# EAGLE schematic SparkFun LoRaSerial 915MHz - 1W (EAGLE 9.6.2)
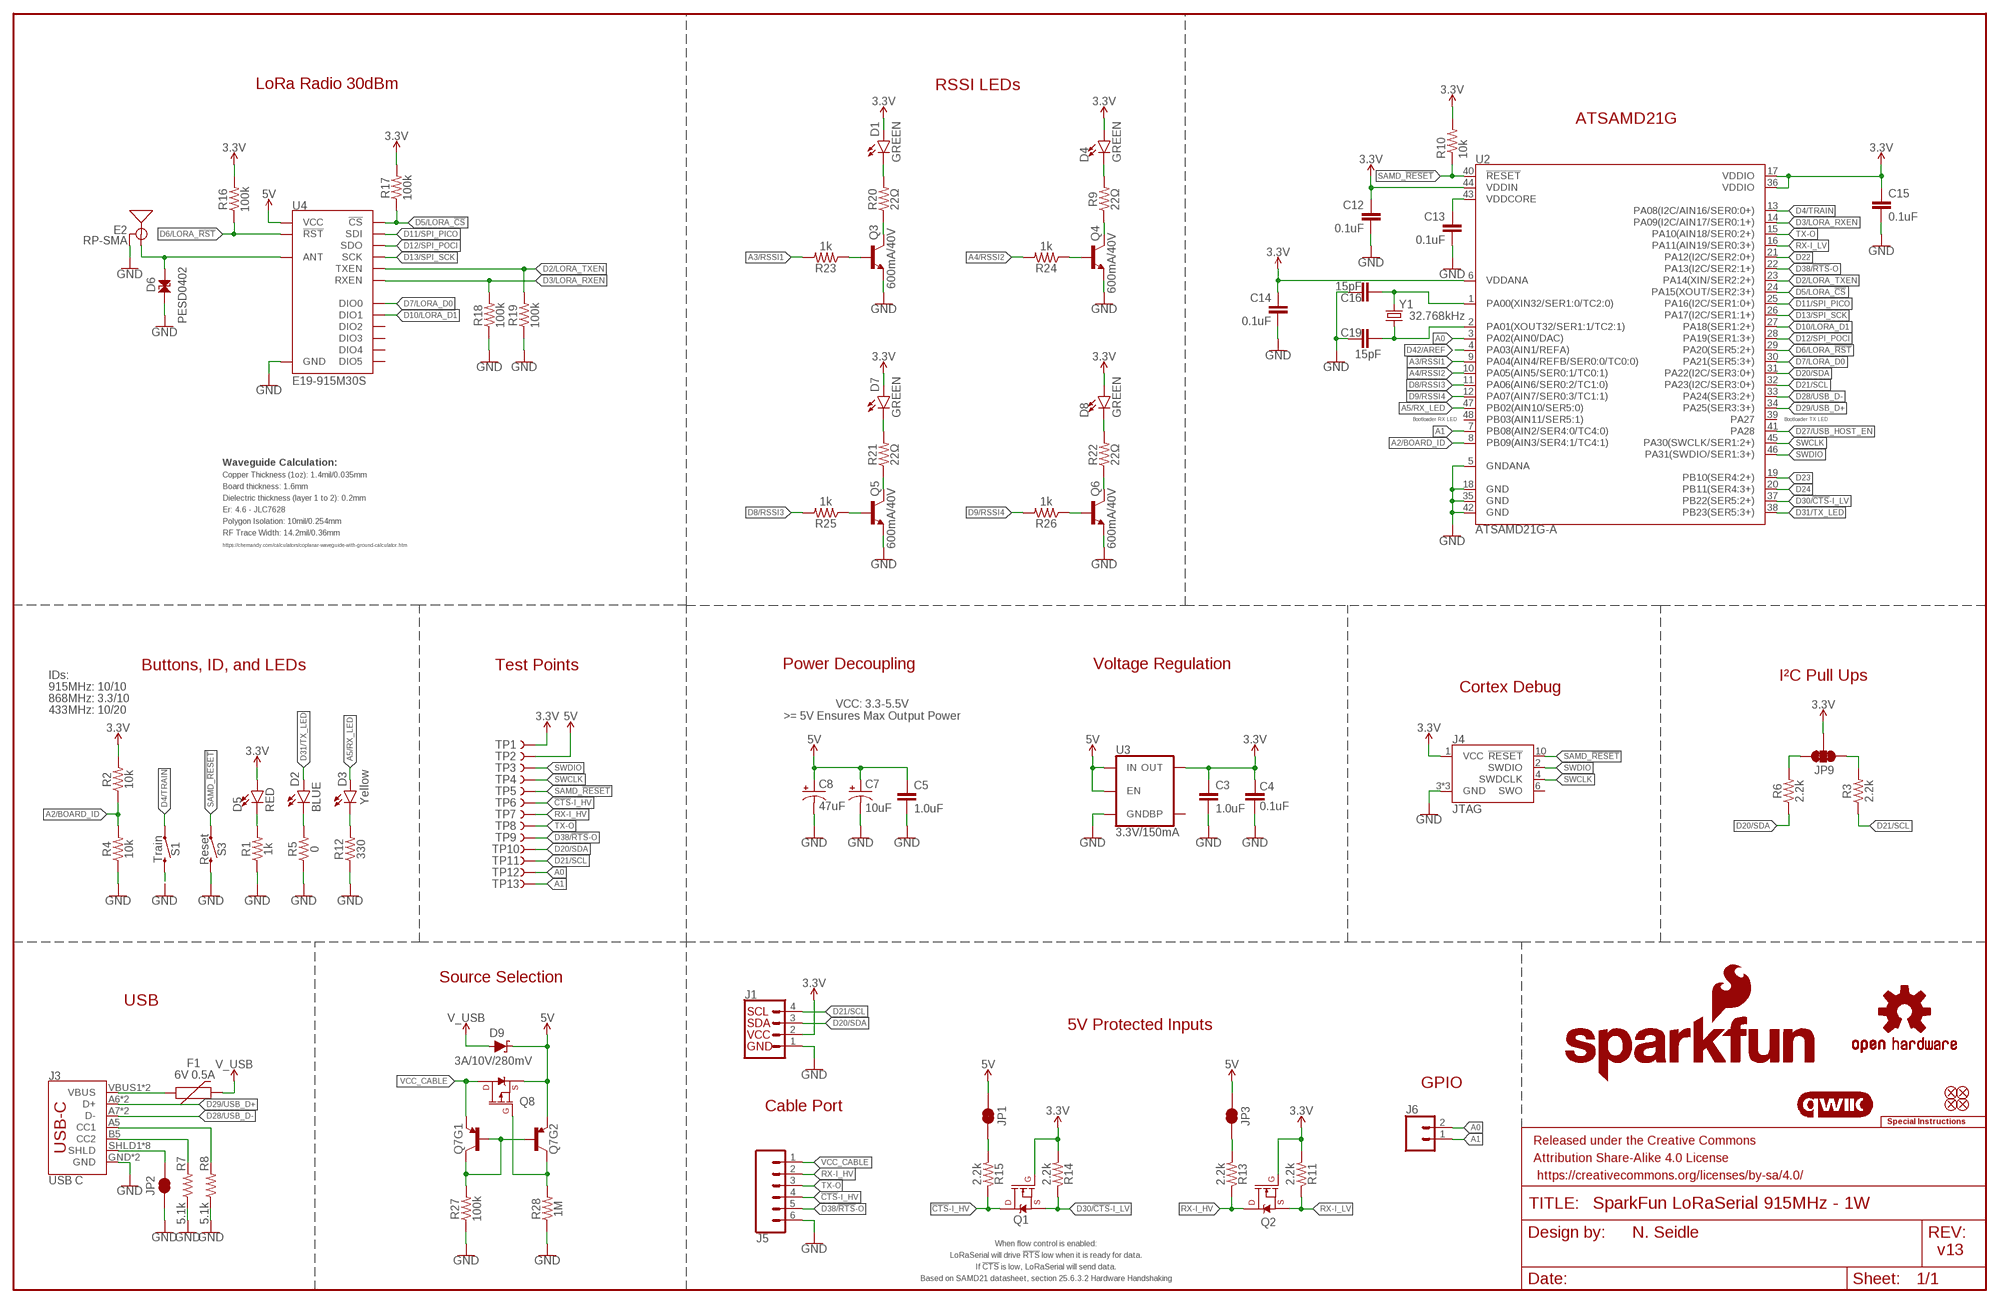
[diagram p0: schematic, sheet 1]

## Parts
C3  1.0uF  1.0UF-0603-16V-10%-X7R  [0603]
C4  0.1uF  0.1UF-0603-25V-5%  [0603]
C5  1.0uF  1.0UF-0603-16V-10%-X7R  [0603]
C7  10uF  10UF-POLAR-EIA3216-16V-10%(TANT)  [EIA3216]
C8  47uF  47UF-POLAR-EIA3528-10V-10%  [EIA3528]
C12  0.1uF  0.1UF-0603-25V-(+80/-20%)  [0603]
C13  0.1uF  0.1UF-0603-25V-(+80/-20%)  [0603]
C14  0.1uF  0.1UF-0603-25V-(+80/-20%)  [0603]
C15  0.1uF  0.1UF-0603-25V-(+80/-20%)  [0603]
C16  15pF  15PF-0603-50V-5%  [0603]
C19  15pF  15PF-0603-50V-5%  [0603]
D1  GREEN  LED-GREEN0603  [LED-0603]
D2  BLUE  LED-BLUE0603  [LED-0603]
D3  Yellow  LED-YELLOW0603  [LED-0603]
D4  GREEN  LED-GREEN0603  [LED-0603]
D5  RED  LED-RED0603  [LED-0603]
D6  PESD0402  PESD0402-0402T  [0402-TIGHT]
D7  GREEN  LED-GREEN0603  [LED-0603]
D8  GREEN  LED-GREEN0603  [LED-0603]
D9  3A/10V/280mV  DIODE-SCHOTTKY-BAT60A  [SOD-323]
E2  RP-SMA  ANTENNA-SMA-GROUNDEDEDGE_RPSMA  [RP-SMA-EDGE]
F1  6V 0.5A  PPTC_6V500MA  [0805]
FID1  FIDUCIAL1X2  [FIDUCIAL-1X2]
FID2  FIDUCIAL1X2  [FIDUCIAL-1X2]
FID3  FIDUCIAL1X2  [FIDUCIAL-1X2]
FID4  FIDUCIAL1X2  [FIDUCIAL-1X2]
FRAME3  FRAME-LEDGER  [CREATIVE_COMMONS]
J1  QWIIC_RIGHT_ANGLE  QWIIC_CONNECTORJS-1MM  [JST04_1MM_RA]
J3  USB C  USB_C16PIN  [USB-C-16P]
J4  JTAG  CORTEX_JTAG_DEBUG_MINIMUM_PTH_NS  [2X5-PTH-1.27MM-NO_SILK]
J5  CONN_06JST-SMD-LOCKING  [JST-6-SMD-1.25MM-LOCKING]
J6  CONN_021X02_NO_SILK  [1X02_NO_SILK]
JP1  JUMPER-SMT_2_NC_TRACE_SILK  [SMT-JUMPER_2_NC_TRACE_SILK]
JP2  JUMPER-SMT_2_NC_TRACE_SILK  [SMT-JUMPER_2_NC_TRACE_SILK]
JP3  JUMPER-SMT_2_NC_TRACE_SILK  [SMT-JUMPER_2_NC_TRACE_SILK]
JP9  JUMPER-SMT_3_2-NC_TRACE_SILK  [SMT-JUMPER_3_2-NC_TRACE_SILK]
LOGO1  SPECIAL_INSTRUCTIONS-ORDERING  [ORDERING_INSTRUCTIONS]
LOGO2  SFE_LOGO_NAME_FLAME9_MM  [SFE_LOGO_NAME_FLAME_9MM]
LOGO3  QWIIC_LOGO_CONNECTOR  [QWIIC_5.5MM]
LOGO4  OSHW-LOGOMINI  [OSHW-LOGO-MINI]
LOGO5  SFE_LOGO_NAME9_MM  [SFE_LOGO_NAME_9MM]
Q1  20V/0.2A/8MHz/1.2Ω/1Vth  MOSFET-NCH-RE1C002UNTCL  [SOT-416FL]
Q2  20V/0.2A/8MHz/1.2Ω/1Vth  MOSFET-NCH-RE1C002UNTCL  [SOT-416FL]
Q3  600mA/40V  TRANS_NPN-MMBT2222AL  [SOT23-3]
Q4  600mA/40V  TRANS_NPN-MMBT2222AL  [SOT23-3]
Q5  600mA/40V  TRANS_NPN-MMBT2222AL  [SOT23-3]
Q6  600mA/40V  TRANS_NPN-MMBT2222AL  [SOT23-3]
Q7  TRANS_PNP_DUALSOT-363  [SOT363_PHILIPS]
Q8  20V/4.2A/52mΩ/1.4W  MOSFET_PCH-DMG2305UX-7  [SOT23-3]
R1  1k  1KOHM-0603-1/10W-1%  [0603]
R2  10k  10KOHM-0603-1/10W-1%  [0603]
R3  2.2k  2.2KOHM-0603-1/10W-1%  [0603]
R4  10k  10KOHM-0603-1/10W-1%  [0603]
R5  0  0OHM-0603-1/10W  [0603]
R6  2.2k  2.2KOHM-0603-1/10W-1%  [0603]
R7  5.1k  5.1KOHM5.1KOHM-0603-1/10W-1%  [0603]
R8  5.1k  5.1KOHM5.1KOHM-0603-1/10W-1%  [0603]
R9  22Ω  22OHM-0603-1/10W-1%  [0603]
R10  10k  10KOHM-0603-1/10W-1%  [0603]
R11  2.2k  2.2KOHM-0603-1/10W-1%  [0603]
R12  330  330OHM-0603-1/10W-1%  [0603]
R13  2.2k  2.2KOHM-0603-1/10W-1%  [0603]
R14  2.2k  2.2KOHM-0603-1/10W-1%  [0603]
R15  2.2k  2.2KOHM-0603-1/10W-1%  [0603]
R16  100k  100KOHM-0603-1/10W-1%  [0603]
R17  100k  100KOHM-0603-1/10W-1%  [0603]
R18  100k  100KOHM-0603-1/10W-1%  [0603]
R19  100k  100KOHM-0603-1/10W-1%  [0603]
R20  22Ω  22OHM-0603-1/10W-1%  [0603]
R21  22Ω  22OHM-0603-1/10W-1%  [0603]
R22  22Ω  22OHM-0603-1/10W-1%  [0603]
R23  1k  1KOHM-0603-1/10W-1%  [0603]
R24  1k  1KOHM-0603-1/10W-1%  [0603]
R25  1k  1KOHM-0603-1/10W-1%  [0603]
R26  1k  1KOHM-0603-1/10W-1%  [0603]
R27  100k  100KOHM-0603-1/10W-1%  [0603]
R28  1M  1MOHM-0603-1/4W-5%  [0603]
S1  Train  MOMENTARY-SWITCH-SPST-SMD-RIGHT-ANGLE  [TACTILE_SWITCH_SMD_RIGHT_ANGLE]
S3  Reset  MOMENTARY-SWITCH-SPST-SMD-5.2-TALL-REDUNDANT  [TACTILE_SWITCH_SMD_5.2MM]
TP1  TEST-POINT3X5  [PAD.03X.05]
TP2  TEST-POINT3X5  [PAD.03X.05]
TP3  TEST-POINT3X5  [PAD.03X.05]
TP4  TEST-POINT3X5  [PAD.03X.05]
TP5  TEST-POINT3X5  [PAD.03X.05]
TP6  TEST-POINT3X5  [PAD.03X.05]
TP7  TEST-POINT3X5  [PAD.03X.05]
TP8  TEST-POINT3X5  [PAD.03X.05]
TP9  TEST-POINT3X5  [PAD.03X.05]
TP10  TEST-POINT3X5  [PAD.03X.05]
TP11  TEST-POINT3X5  [PAD.03X.05]
TP12  TEST-POINT3X5  [PAD.03X.05]
TP13  TEST-POINT3X5  [PAD.03X.05]
U2  ATSAMD21G-A  [TQFP-48]
U3  3.3V/150mA  V_REG_MIC52053.3V  [SOT23-5]
U4  E19-915M30S  LORA-E19915MHZ  [E19-915M30S]
Y1  32.768kHz  CRYSTAL3.2X1.5MM  [CRYSTAL-SMD-3.2X1.5MM]

## Nets
3.3V [power]: C3.1 C4.2 C12.1 C14.1 C15.1 D1.A D4.A D5.A D7.A D8.A J1.2 J4.1(VCC) JP9.2 Q1.1(G) Q2.1(G) R2.2 R10.2 R11.2 R14.2 R16.2 R17.2 TP1.1 U2.6(VDDANA) U2.17(VDDIO) U2.36(VDDIO) U2.44(VDDIN) U3.5(OUT)
5V: C5.1 C7.+ C8.A(+) D9.C JP1.2 JP3.2 Q7.4(E) Q8.2(S) TP2.1 U3.1(IN) U3.3(EN) U4.11(VCC)
!CTS!-I_HV: J5.4 Q1.3(D) R15.1 TP6.1
A0: J6.2 TP12.1 U2.3(PA02(AIN0/DAC))
A1: J6.1 TP13.1 U2.7(PB08(AIN2/SER4:0/TC4:0))
A2/BOARD_ID: R2.1 R4.2 U2.8(PB09(AIN3/SER4:1/TC4:1))
A3/RSSI1: R23.2 U2.9(PA04(AIN4/REFB/SER0:0/TC0:0))
A4/RSSI2: R24.2 U2.10(PA05(AIN5/SER0:1/TC0:1))
A5/RX_LED: D3.A U2.47(PB02(AIN10/SER5:0))
CC1: J3.A5(CC1) R8.2
CC2: J3.B5(CC2) R7.2
D2/LORA_TXEN: R19.2 U2.23(PA14(XIN/SER2:2+)) U4.16(TXEN)
D3/LORA_RXEN: R18.2 U2.14(PA09(I2C/AIN17/SER0:1+)) U4.17(RXEN)
D4/TRAIN: S1.1 U2.13(PA08(I2C/AIN16/SER0:0+))
D5/LORA_!CS!: R17.1 U2.24(PA15(XOUT/SER2:3+)) U4.15(!CS)
D6/LORA_!RST!: R16.1 U2.29(PA20(SER5:2+)) U4.8(!RST)
D7/LORA_D0: U2.30(PA21(SER5:3+)) U4.7(DIO0)
D8/RSSI3: R25.2 U2.11(PA06(AIN6/SER0:2/TC1:0))
D9/RSSI4: R26.2 U2.12(PA07(AIN7/SER0:3/TC1:1))
D10/LORA_D1: U2.27(PA18(SER1:2+)) U4.6(DIO1)
D11/SPI_PICO: U2.25(PA16(I2C/SER1:0+)) U4.14(SDI)
D12/SPI_POCI: U2.28(PA19(SER1:3+)) U4.13(SDO)
D13/SPI_SCK: U2.26(PA17(I2C/SER1:1+)) U4.12(SCK)
D20/SDA: J1.3 R6.1 TP10.1 U2.31(PA22(I2C/SER3:0+))
D21/SCL: J1.4 R3.1 TP11.1 U2.32(PA23(I2C/SER3:0+))
D22: U2.21(PA12(I2C/SER2:0+))
D23: U2.19(PB10(SER4:2+))
D24: U2.20(PB11(SER4:3+))
D27/USB_HOST_EN: U2.41(PA28)
D28/USB_D-: J3.A7(D-) J3.B7(D-) U2.33(PA24(SER3:2+))
D29/USB_D+: J3.A6(D+) J3.B6(D+) U2.34(PA25(SER3:3+))
D30/!CTS!-I_LV: Q1.2(S) R14.1 U2.37(PB22(SER5:2+))
D31/TX_LED: D2.A U2.38(PB23(SER5:3+))
D38/!RTS!-O: J5.5 TP9.1 U2.22(PA13(I2C/SER2:1+))
D42/AREF: U2.4(PA03(AIN1/REFA))
GND: C3.2 C4.1 C5.2 C7.- C8.C(-) C12.2 C13.2 C14.2 C15.2 C16.1 C19.2 D6.1 E2.GND@0(GND) E2.GND@1(GND) E2.GND@2(GND) E2.GND@3(GND) J1.1 J3.GND J3.GND2(GND) J4.3(GND) J4.5(GND) J4.9(GND) J5.6 JP2.1 Q3.2(E) Q4.2(E) Q5.2(E) Q6.2(E) R1.1 R4.1 R5.1 R7.1 R8.1 R12.1 R18.1 R19.1 R27.1 R28.1 S1.2 S3.3 S3.4 U2.5(GNDANA) U2.18(GND) U2.35(GND) U2.42(GND) U3.2(GND) U4.1(GND) U4.9(GND) U4.10(GND) U4.18(GND) U4.20(GND) U4.21(GND) U4.22(GND)
LORA_ANT: D6.2 E2.SIG(SIGNAL) U4.19(ANT)
N$1: C19.1 U2.2(PA01(XOUT32/SER1:1/TC2:1)) Y1.P$1
N$2: C16.2 U2.1(PA00(XIN32/SER1:0/TC2:0)) Y1.P$2
N$3: D3.C R12.2
N$4: D2.C R5.2
N$5: JP3.1 R13.2
N$6: JP1.1 R15.2
N$7: D5.C R1.2
N$8: D4.C R9.2
N$9: D1.C R20.2
N$10: D7.C R21.2
N$11: D8.C R22.2
N$12: Q3.3(C) R20.1
N$13: Q3.1(B) R23.1
N$14: Q4.3(C) R9.1
N$15: Q4.1(B) R24.1
N$16: Q5.3(C) R21.1
N$17: Q5.1(B) R25.1
N$18: Q6.3(C) R22.1
N$19: Q6.1(B) R26.1
N$20: J3.SHLD1(SHLD) J3.SHLD2(SHLD) J3.SHLD3(SHLD) J3.SHLD4(SHLD) J3.SHLD5(SHLD) J3.SHLD6(SHLD) J3.SHLD7(SHLD) J3.SHLD8(SHLD) JP2.2
N$21: Q7.3(C) Q8.1(G) R28.2
N$22: Q7.2(B) Q7.5(B) Q7.6(C) R27.2
RX-I_HV: J5.2 Q2.3(D) R13.1 TP7.1
RX-I_LV: Q2.2(S) R11.1 U2.16(PA11(AIN19/SER0:3+))
SAMD_!RESET!: J4.10(!RESET) R10.1 S3.1 S3.2 TP5.1 U2.40(!RESET!)
SCL_PU1: JP9.1 R3.2
SDA_PU1: JP9.3 R6.2
SWCLK: J4.4(SWDCLK) TP4.1 U2.45(PA30(SWCLK/SER1:2+))
SWDIO: J4.2(SWDIO) TP3.1 U2.46(PA31(SWDIO/SER1:3+))
TX-O: J5.3 TP8.1 U2.15(PA10(AIN18/SER0:2+))
V_USB: D9.A F1.2
VCC_CABLE: J5.1 Q7.1(E) Q8.3(D)
VDDCORE: C13.1 U2.43(VDDCORE)
VUSB [power]: F1.1 J3.VBUS1(VBUS) J3.VBUS2(VBUS)
Unconnected: J4.6(SWO) U2.39(PA27) U2.48(PB03(AIN11/SER5:1)) U3.4(BP) U4.2(DIO5) U4.3(DIO4) U4.4(DIO3) U4.5(DIO2)

## Notes on the sheet
- LoRa Radio 30dBm | RSSI LEDs
- ATSAMD21G
- Bootloader RX LED | Bootloader TX LED
- Waveguide Calculation:
- Copper Thickness (1oz): 1.4mil/0.035mm
- Board thickness: 1.6mm
- Dielectric thickness (layer 1 to 2): 0.2mm
- Er: 4.6 - JLC7628
- Polygon Isolation: 10mil/0.254mm
- RF Trace Width: 14.2mil/0.36mm
- https://chemandy.com/calculators/coplanar-waveguide-with-ground-calculator.htm
- Buttons, ID, and LEDs | Test Points | Power Decoupling | Voltage Regulation
- IDs: | I²C Pull Ups
- 915MHz: 10/10 | Cortex Debug
- 868MHz: 3.3/10
- 433MHz: 10/20
- VCC: 3.3-5.5V
  >= 5V Ensures Max Output Power
- Source Selection
- USB
- 5V Protected Inputs
- GPIO
- Cable Port
- N. Seidle
- When flow control is enabled:
- LoRaSerial will drive !RTS! low when it is ready for data. | v13
- If !CTS! is low, LoRaSerial will send data.
- Based on SAMD21 datasheet, section 25.6.3.2 Hardware Handshaking

## Library data of the parts
C3 C5 = SparkFun-Capacitors:1.0UF: 1µF ceramic capacitors A capacitor is a passive two-terminal electrical component used to store electrical energy temporarily in an electric field.; PROD_ID: CAP-13930
C4 = SparkFun-Capacitors:0.1UF: 0.1µF ceramic capacitors A capacitor is a passive two-terminal electrical component used to store electrical energy temporarily in an electric field.; PROD_ID: CAP-08604
C7 = SparkFun-Capacitors:10UF-POLAR: 10.0µF polarized capacitors A capacitor is a passive two-terminal electrical component used to store electrical energy temporarily in an electric field.; PROD_ID: CAP-00811
C8 = SparkFun-Capacitors:47UF-POLAR: 47µF polarized capacitors A capacitor is a passive two-terminal electrical component used to store electrical energy temporarily in an electric field.; PROD_ID: CAP-08310
C12-C15 = SparkFun-Capacitors:0.1UF: 0.1µF ceramic capacitors A capacitor is a passive two-terminal electrical component used to store electrical energy temporarily in an electric field.; PROD_ID: CAP-00810
C16 C19 = SparkFun-Capacitors:15PF: 15pF ceramic capacitors A capacitor is a passive two-terminal electrical component used to store electrical energy temporarily in an electric field.; PROD_ID: CAP-07881
D1 D4 D7 D8 = SparkFun-LED:LED-GREEN: Green SMD LED Used in manufacturing of various products at SparkFun Packages: 0603 - SMD 0603 package [Product Link] <http://www.futureelectronics.com/en/technologies/semiconductors/optoelectronics/leds/Pages/9894312-LTST-C190GKT.aspx?CrossPart=HSMG-C190&IM=0> LilyPad 1206 - SMD1206 LilyPad package [Product Link] <http://www.futureelectronics.com/en/Technologies/Product.aspx?ProductID=IN150NGHARVATEKCORPORATION2049943&IM=0> 1206 - SMD1206 package [Product Link] <http://www.futureelectronics.com/en/technologies/semiconductors/optoelectronics/leds/Pages/8315665-LTST-C150KGKT.aspx?IM=0> 1206 Bottom Mount -SMD 1206 Bottom Mount [Product Link] <http://www.digikey.com/product-detail/en/lite-on-inc/LTST-C230KGKT/160-1456-1-ND/386854> SparkFun Products: Pro Mini 328 -5V <https://www.sparkfun.com/products/821> RedBoard <https://www.sparkfun.com/products/12757> MP3 Trigger <https://www.sparkfun.com/products/13720> Makey Makey <https://www.sparkfun.com/products/11076>; PROD_ID: DIO-00821
D2 = SparkFun-LED:LED-BLUE: Blue SMD LED Used in manufacturing of various products at SparkFun Packages: 0603 - SMD 0603 package [Product Link] <http://www.digikey.com/product-detail/en/SMLE12BC7TT86/511-1589-2-ND/1641808> 1206 - SMD1206 package [Product Link] <http://www.digikey.com/product-detail/en/lite-on-inc/LTST-C150TBKT/160-1643-1-ND/573584> SparkFun Products: ESP8266 Thing-Dev Board <https://www.sparkfun.com/products/13711> RedBoard <https://www.sparkfun.com/products/12757>; PROD_ID: DIO-08575
D3 = SparkFun-LED:LED-YELLOW: Yellow SMD LED Used in manufacturing several products at SparkFun. Packages: 0603 - SMD 0603 package[Product Link] <http://www.kingbrightusa.com/product.asp?catalog_name=LED&product_id=APT1608SYCK> 0603 -SMART - SMART SMD 0603 package (more efficient/more expensive) [Product Link] <http://www.osram-os.com/osram_os/en/products/product-catalog/led-light-emitting-diodes/smartled-0603/ly-l29k/index.jsp> LilyPad - SMD1206 package[Product Datasheet] <https://www.sparkfun.com/datasheets/DevTools/LilyPad/Q150YUS4.pdf> SparkFun Products: Blynk Board <https://www.sparkfun.com/products/13794> IOIO-OTG <https://www.sparkfun.com/products/13613> XBee Explorer Serial <https://www.sparkfun.com/products/13225>; PROD_ID: DIO-09003
D5 = SparkFun-LED:LED-RED: Red SMD LED Used in manufacturing of most products at SparkFun Packages: 0603 - SMD 0603 package [Product Link] <http://docs.avagotech.com/docs/AV02-0551EN> 0603 SMART - SMD 0603 SMART package ( more efficient and expensive)[Product Link] <http://www.osram-os.com/Graphics/XPic2/00077099_0.pdf> 1206 - SMD1206 package [Product Link] <https://www.sparkfun.com/datasheets/DevTools/LilyPad/Q150OVS4.pdff> SparkFun Products: Pro Mini 328 -5V <https://www.sparkfun.com/products/821> RedBoard <https://www.sparkfun.com/products/12757> IOIO-OTG <https://www.sparkfun.com/products/13613>; PROD_ID: DIO-00819
D6 = SparkFun-DiscreteSemi:PESD0402: ESD protection diode PESD is used to protect a signal line from ESD.; PROD_ID: DIO-15359
D9 = SparkFun-DiscreteSemi:DIODE-SCHOTTKY: Schottky diode A Schottky diode is a semiconductor diode which has a low forward voltage drop and a very fast switching action.; PROD_ID: DIO-14072
E2 = SparkFun-RF:ANTENNA-SMA-GROUNDED: SMA Antenna Connector w/ Ground Edge-mount and SMD SMA connectors for RF Antennas. **4-LAYER BOARD WARNING!!** When designing a 4-layer board using any of the SMD variants, you will need to manually add a cutout polygon on any internal power layers to make sure that you don't end up with exposed copper around the edge of the routed hole for these connectors. Exposed power copper could then short to the connector body - and that would be bad. Why hasn't anyone added the cutout polygons directly to the connector footprint? Well, your internal layers (usually 2 and 15) may be covered with GND polygons and you might well want the copper to go all the way to the edge, especially under the connector SIGNAL pin. So adding cutouts to the footprint might make matters worse, not better...; PROD_ID: CONN-00827
F1 = SparkFun-Fuses:PPTC: Resettable Fuse PPTC Resettable Fuse. Really a sort of resistor with a polymeric positive temperature coefficient whose resistance increases dramatically with an increase in temperature. When heated by the power passing through the resistance rises causing the current to be limited, protecting the circuit. This is achieved by the transition of the polymer from a crystalline to an amorphous state where the conductive carbon separates breaking the conductive pathways found in the cool crystalline structure. When a PPTC cools back down it resumes conducting letting the circuit turn back on. SparkFun Products: SparkFun RedBoard - Programmed with Arduino <https://www.sparkfun.com/products/12757> Pro Micro - 5V/16MHz <https://www.sparkfun.com/products/12640> Arduino Pro 328 - 5V/16MHz <https://www.sparkfun.com/products/10915> MP3 Trigger <https://www.sparkfun.com/products/13720>; PROD_ID: RES-13945
FID1-FID4 = SparkFun-Aesthetics:FIDUCIAL: Fiducial Alignment Points Point-of-reference for pick-and-place machines and other optical instruments.
FRAME3 = SparkFun-Aesthetics:FRAME-LEDGER: Schematic Frame - Ledger Standard 11x14 US Ledger frame
J1 = SparkFun-Connectors:QWIIC_CONNECTOR: SparkFun I2C Standard Qwiic Connector An SMD 1mm pitch JST connector makes it easy and quick (get it? Qwiic?) to connect I2C devices to each other. The Qwiic system <http://www.sparkfun.com/qwiic> enables fast and solderless connection between popular platforms and various sensors and actuators. We carry 200mm <https://www.sparkfun.com/products/14204>, 100mm <https://www.sparkfun.com/products/14205>, 50mm <https://www.sparkfun.com/products/14206>, and breadboard friendly <https://www.sparkfun.com/products/14207> Qwiic cables. We also offer 10 pcs strips <https://www.sparkfun.com/products/14323> the SMD connectors.; PROD_ID: CONN-13694
J3 = USB-C:USB_C: USB Type C 16Pin Connector
J4 = SparkFun-Connectors:CORTEX_JTAG_DEBUG_MINIMUM: Cortex Debug Connector - 10 pin Supports JTAG debug, Serial Wire debug, and Serial Wire Viewer. PTH and SMD connector options available. General Connector Information <http://infocenter.arm.com/help/topic/com.arm.doc.faqs/attached/13634/cortex_debug_connectors.pdf> Products: PTH Connector <http://www.digikey.com/product-detail/en/cnc-tech/3220-10-0100-00/1175-1627-ND/3883661> -via Digi-Key SparkFun PSoc <https://www.sparkfun.com/products/13229> SparkFun T <https://www.sparkfun.com/products/13810>
J5 = SparkFun-Connectors:CONN_06: Multi connection point. Often used as Generic Header-pin footprint for 0.1 inch spaced/style header connections On any of the 0.1 inch spaced packages, you can populate with these: Break Away Headers - Straight <https://www.sparkfun.com/products/116> (PRT-00116) Break Away Male Headers - Right Angle <https://www.sparkfun.com/products/553> (PRT-00553) Female Headers <https://www.sparkfun.com/products/115> (PRT-00115) Break Away Headers - Machine Pin <https://www.sparkfun.com/products/117> (PRT-00117) Break Away Female Headers - Swiss Machine Pin <https://www.sparkfun.com/products/743> (PRT-00743) Arduino Stackable Header - 6 Pin <https://www.sparkfun.com/products/9280> (PRT-09280) For SCREWTERMINALS and SPRING TERMINALS visit here: Screw Terimnals on SparkFun.com <https://www.sparkfun.com/search/results?term=Screw+Terminals> (5mm/3.5mm/2.54mm spacing) This device is also useful as a general connection point to wire up your design to another part of your project. Our various solder wires solder well into these plated through hole pads. Hook-Up Wire - Assortment (Stranded, 22 AWG) <https://www.sparkfun.com/products/11375> (PRT-11375) Hook-Up Wire - Assortment (Solid Core, 22 AWG) <https://www.sparkfun.com/products/11367> (PRT-11367) View the entire wire category on our website here <https://www.sparkfun.com/categories/141>; PROD_ID: CONN-16497
J6 = SparkFun-Connectors:CONN_02: Multi connection point. Often used as Generic Header-pin footprint for 0.1 inch spaced/style header connections On any of the 0.1 inch spaced packages, you can populate with these: Break Away Headers - Straight <https://www.sparkfun.com/products/116> (PRT-00116) Break Away Male Headers - Right Angle <https://www.sparkfun.com/products/553> (PRT-00553) Female Headers <https://www.sparkfun.com/products/115> (PRT-00115) Break Away Headers - Machine Pin <https://www.sparkfun.com/products/117> (PRT-00117) Break Away Female Headers - Swiss Machine Pin <https://www.sparkfun.com/products/743> (PRT-00743) For SCREWTERMINALS and SPRING TERMINALS visit here: Screw Terimnals on SparkFun.com <https://www.sparkfun.com/search/results?term=Screw+Terminals> (5mm/3.5mm/2.54mm spacing) This device is also useful as a general connection point to wire up your design to another part of your project. Our various solder wires solder well into these plated through hole pads. Hook-Up Wire - Assortment (Stranded, 22 AWG) <https://www.sparkfun.com/products/11375> (PRT-11375) Hook-Up Wire - Assortment (Solid Core, 22 AWG) <https://www.sparkfun.com/products/11367> (PRT-11367) View the entire wire category on our website here <https://www.sparkfun.com/categories/141> Special notes: Molex polarized connector foot print use with: PRT-08233 with associated crimp pins and housings. 2.54_SCREWTERM for use with PRT-10571. 3.5mm Screw Terminal footprints for PRT-08084 5mm Screw Terminal footprints for use with PRT-08432
JP1-JP3 = SparkFun-Jumpers:JUMPER-SMT_2_NC_TRACE: Normally closed trace jumper This jumper has a trace between two pads so it's normally closed (NC). Use a razor knife to open the connection. For best results follow the IPC guidelines for cutting traces: Cutout at least 0.063 mm (0.005 in). Remove all loose material to clean up the cut area. Seal the cut with an approved epoxy. Reapply solder to reclose the connection.
JP9 = SparkFun-Jumpers:JUMPER-SMT_3_2-NC_TRACE: Normally closed trace jumper (2 of 2 connections) This jumper has a trace between all three pads so they are normally closed (NC). Use a razor knife to open the connection(s). For best results follow the IPC guidelines for cutting traces: Cutout at least 0.063 mm (0.005 in). Remove all loose material to clean up the cut area. Seal the cut with an approved epoxy. Reapply solder to reclose the connection(s).
LOGO1 = SparkFun-Aesthetics:SPECIAL_INSTRUCTIONS: Special Ordering/Production Instructions Alert Symbol for special PCB ordering instructions or unique production process warnings. Ordering Instructions Production Instructions Types of information that should be added to box: Copper weight Soldermask color Silk color PCB thickness Number of layers PCB Standard: 1.6mm FR4 1 oz copper immersion silver plating red soldermask white silkscreen Types of information that should be added to box: Special wash requirements Depaneling instructions Humidification Glue curing Default text settings: 0.07 inch 9% ratio 50% line distance
LOGO2 = SparkFun-Aesthetics:SFE_LOGO_NAME_FLAME: SparkFun Font Logo w/ Flame This is the SparkFun full logo. The logo on the schematic will always be the same size; the package variant is the height of the flame part of the logo. Default layer for the logo on the board is tSilk.
LOGO3 = SparkFun-Aesthetics:QWIIC_LOGO: Qwiic Logos for placement on schematic and PCB. The 5.5mm silk logo is best for placing next to Qwiic connector.
LOGO4 = SparkFun-Aesthetics:OSHW-LOGO: Open-Source Hardware (OSHW) Logo This logo indicates the piece of hardware it is found on incorporates a OSHW license and/or adheres to the definition of open source hardware found here: http://freedomdefined.org/OSHW
LOGO5 = SparkFun-Aesthetics:SFE_LOGO_NAME: SparkFun Font Logo This is the SparkFun name logo. The logo on the schematic will always be the same size; the package variant is the height of the flame part of the logo (or the height the flame would be, if it were drawn). Default layer for the logo on the board is tSilk.
Q1 Q2 = SparkFun-DiscreteSemi:MOSFET-NCH: N-channel MOSFETs Voltage controlled devices that allow control of high current outputs. SparkFun Products: SparkFun OpenScale <https://www.sparkfun.com/products/13261> SparkFun Digital Sandbox <https://www.sparkfun.com/products/12651> SparkFun Monster Moto Shield <https://www.sparkfun.com/products/10182> SparkFun MOSFET Power Controller <https://www.sparkfun.com/products/11214>; PROD_ID: TRANS-14399
Q3-Q6 = SparkFun-DiscreteSemi:TRANS_NPN: NPN transistor Current controlled devices typically used to amplify current or used as a switch. BC547 - COM-08928 <http://www.sparkfun.com/products/8928> (TO-92 45V 100mA) (1.Collector 2.Base 3.Emitter) 2N3904 - COM-00521 <http://www.sparkfun.com/products/521> (TO-92 40V 200mA) (1.Emitter 2.Base 3.Collector) P2N2222A - COM-12852 <http://www.sparkfun.com/products/12852> (TO-92 40V 600mA) (1.Collector 2.Base 3.Emitter); PROD_ID: TRANS-08049
Q7 = SparkFun-DiscreteSemi:TRANS_PNP_DUAL: Dual PNP Transistors in Single Package The BCM857BS puts two PNP transistors in a single package. Bipolar (BJT) Transistor Array 2 PNP (Dual) 45V 100mA 100MHz 200mW Surface Mount SOT-363 Datasheet <https://www.diodes.com/assets/Datasheets/BCM857BS.pdf> SparkFun Products: SparkFun Pi Servo HAT V2 <https://www.sparkfun.com>; PROD_ID: TRANS-14386
Q8 = SparkFun-DiscreteSemi:MOSFET_PCH: P-channel MOSFETs Voltage controlled devices that allow control of high current outputs. SparkFun Products: SparkFun ESP32 Thing <https://www.sparkfun.com/products/13907> SparkFun ESP8266 Thing <https://www.sparkfun.com/products/13231> SparkFun Pi Servo HAT V2 <https://www.sparkfun.com/products/15316> DMG2305UX-7 (20V/4.2A/SOT23-3); PROD_ID: TRANS-14388
R1 R23-R26 = SparkFun-Resistors:1KOHM: 1kΩ resistor A resistor is a passive two-terminal electrical component that implements electrical resistance as a circuit element. Resistors act to reduce current flow, and, at the same time, act to lower voltage levels within circuits. - Wikipedia; PROD_ID: RES-07856
R2 R4 R10 = SparkFun-Resistors:10KOHM: 10kΩ resistor A resistor is a passive two-terminal electrical component that implements electrical resistance as a circuit element. Resistors act to reduce current flow, and, at the same time, act to lower voltage levels within circuits. - Wikipedia; PROD_ID: RES-00824
R3 R6 R11 R13-R15 = SparkFun-Resistors:2.2KOHM: 2.2kΩ resistor A resistor is a passive two-terminal electrical component that implements electrical resistance as a circuit element. Resistors act to reduce current flow, and, at the same time, act to lower voltage levels within circuits. - Wikipedia; PROD_ID: RES-08272
R5 = SparkFun-Resistors:0OHM: 0Ω resistor A resistor is a passive two-terminal electrical component that implements electrical resistance as a circuit element. Resistors act to reduce current flow, and, at the same time, act to lower voltage levels within circuits. - Wikipedia; PROD_ID: RES-08609
R7 R8 = SparkFun-Resistors:5.1KOHM; PROD_ID: RES-12083
R9 R20-R22 = SparkFun-Resistors:22OHM: 22Ω resistor A resistor is a passive two-terminal electrical component that implements electrical resistance as a circuit element. Resistors act to reduce current flow, and, at the same time, act to lower voltage levels within circuits. - Wikipedia; PROD_ID: RES-08698
R12 = SparkFun-Resistors:330OHM: 330Ω resistor A resistor is a passive two-terminal electrical component that implements electrical resistance as a circuit element. Resistors act to reduce current flow, and, at the same time, act to lower voltage levels within circuits. - Wikipedia; PROD_ID: RES-00818
R16-R19 R27 = SparkFun-Resistors:100KOHM: 100kΩ resistor A resistor is a passive two-terminal electrical component that implements electrical resistance as a circuit element. Resistors act to reduce current flow, and, at the same time, act to lower voltage levels within circuits. - Wikipedia; PROD_ID: RES-07828
R28 = SparkFun-Resistors:1MOHM: 1MΩ resistor A resistor is a passive two-terminal electrical component that implements electrical resistance as a circuit element. Resistors act to reduce current flow, and, at the same time, act to lower voltage levels within circuits. - Wikipedia; PROD_ID: RES-07868
S1 = SparkFun-Switches:MOMENTARY-SWITCH-SPST: Momentary Switch (Pushbutton) - SPST Normally-open (NO) SPST momentary switches (buttons, pushbuttons). Variants PTH-12MM - 12mm square, through-hole Momentary Pushbutton Switch - 12mm Square <https://www.sparkfun.com/products/9190> (COM-09190) PTH-6.0MM, PTH-6.0MM-KIT - 6.0mm square, through-hole Mini Pushbutton Switch <https://www.sparkfun.com/products/97> (COM-00097) KIT package intended for soldering kit's - only one side of pads' copper is exposed. PTH-RIGHT-ANGLE-KIT - Right-angle, through-hole Right Angle Tactile Button <https://www.sparkfun.com/products/10791> - Used on SparkFun BigTime Watch Kit <https://www.sparkfun.com/products/11734> SMD-12MM - 12mm square, surface-mount Tactile Button - SMD (12mm) <https://www.sparkfun.com/products/12993> (COM-12993) Used on SparkFun PicoBoard <https://www.sparkfun.com/products/11888> SMD-4.5MM - 4.5mm Square Trackball Switch Used on SparkFun Blackberry Trackballer Breakout <https://www.sparkfun.com/products/13169> SMD-4.6MMX2.8MM - 4.60mm x 2.80mm, surface mount Used on SparkFun Pro Micro - RP2040 <https://www.sparkfun.com/products/17717> SMD-5.2MM, SMD-5.2-REDUNDANT - 5.2mm square, surface-mount Mini Pushbutton Switch - SMD <https://www.sparkfun.com/products/8720> (COM-08720) Used on Arduino Pro Mini <https://www.sparkfun.com/products/11114> REDUNDANT package connects both switch circuits together SMD-6.0X3.5MM - 6.0 x 3.5mm, surface mount Momentary Reset Switch SMD <https://www.sparkfun.com/products/8229> (COM-08229) SMD-6.2MM-TALL - 6.2mm square, surface mount Tactile Button - SMD (6mm) <https://www.sparkfun.com/products/12992> Used on SparkFun Digital Sandbox <https://www.sparkfun.com/products/12651> SMD-RIGHT-ANGLE - Right-angle, surface mount Used on SparkFun Block for Intel® Edison - Arduino <https://www.sparkfun.com/products/13036>; PROD_ID: COMP-12265
S3 = SparkFun-Switches:MOMENTARY-SWITCH-SPST: Momentary Switch (Pushbutton) - SPST Normally-open (NO) SPST momentary switches (buttons, pushbuttons). Variants PTH-12MM - 12mm square, through-hole Momentary Pushbutton Switch - 12mm Square <https://www.sparkfun.com/products/9190> (COM-09190) PTH-6.0MM, PTH-6.0MM-KIT - 6.0mm square, through-hole Mini Pushbutton Switch <https://www.sparkfun.com/products/97> (COM-00097) KIT package intended for soldering kit's - only one side of pads' copper is exposed. PTH-RIGHT-ANGLE-KIT - Right-angle, through-hole Right Angle Tactile Button <https://www.sparkfun.com/products/10791> - Used on SparkFun BigTime Watch Kit <https://www.sparkfun.com/products/11734> SMD-12MM - 12mm square, surface-mount Tactile Button - SMD (12mm) <https://www.sparkfun.com/products/12993> (COM-12993) Used on SparkFun PicoBoard <https://www.sparkfun.com/products/11888> SMD-4.5MM - 4.5mm Square Trackball Switch Used on SparkFun Blackberry Trackballer Breakout <https://www.sparkfun.com/products/13169> SMD-4.6MMX2.8MM - 4.60mm x 2.80mm, surface mount Used on SparkFun Pro Micro - RP2040 <https://www.sparkfun.com/products/17717> SMD-5.2MM, SMD-5.2-REDUNDANT - 5.2mm square, surface-mount Mini Pushbutton Switch - SMD <https://www.sparkfun.com/products/8720> (COM-08720) Used on Arduino Pro Mini <https://www.sparkfun.com/products/11114> REDUNDANT package connects both switch circuits together SMD-6.0X3.5MM - 6.0 x 3.5mm, surface mount Momentary Reset Switch SMD <https://www.sparkfun.com/products/8229> (COM-08229) SMD-6.2MM-TALL - 6.2mm square, surface mount Tactile Button - SMD (6mm) <https://www.sparkfun.com/products/12992> Used on SparkFun Digital Sandbox <https://www.sparkfun.com/products/12651> SMD-RIGHT-ANGLE - Right-angle, surface mount Used on SparkFun Block for Intel® Edison - Arduino <https://www.sparkfun.com/products/13036>; PROD_ID: SWCH-14139
TP1-TP13 = SparkFun-Connectors:TEST-POINT: SparkFun Test Points Bare copper test points for troubleshooting or In-Circuit-Testing. These are used by our Production team for verifying production board runs using pogo-pins on test beds. SparkFun Products: SparkFun LSM9DS1 Breakout <https://www.sparkfun.com/products/13284> SparkFun PSOC <https://www.sparkfun.com/products/13714> SparkFun Load Cell Amplifier <https://www.sparkfun.com/products/13879>
U2 = samd21-temp:ATSAMD21G: Atmel SAMD21G SMART ARM-Based Microcontroller The Atmel ® | SMART ™ SAM D21 is a series of low-power microcontrollers using the 32-bit ARM ® Cortex ® -M0+ processor, and ranging from 32- to 64-pins with up to 256KB Flash and 32KB of SRAM. The SAM D21 devices operate at a maximum frequency of 48MHz and reach 2.46 CoreMark/MHz. They are designed for simple and intuitive migration with identical peripheral modules, hex compatible code, identical linear address map and pin compatible migration paths between all devices in the product series. All devices include intelligent and flexible peripherals, Atmel Event System for inter-peripheral signaling, and support for capacitive touch button, slider and wheel user interfaces.; PROD_ID: IC-13064
U3 = SparkFun-IC-Power:V_REG_MIC5205: V_REG MIC5205 Standard 3.3V, 5V, and Adjustable 150mA LDO voltage regulator in SOT-23 layout. Micrel part MIC5205. BP (by-pass) pin is used to lower output noise with 470pF cap, may be left open. On the adjustable version BP is used to set output.; PROD_ID: VREG-00822
U4 = SparkFun-RF:LORA-E19: Chengdu Ebyte E19-915M30S - 915/868/433MHz LoRa (FSK) TRX Using SX1276 This is a LoRa (or optionally FSK) modulated transciver bassed on the Semtech SX1276. It has a high ouput power of 1W an a pre-installed U.FL connector. Can be used with LoRa WAN with DIO0, DIO1, and DIO2 hooked up to controller interrupt inputs SparkFun Products: SAMD21 Pro RF 1W <https://www.sparkfun.com/products/15034>; PROD_ID: IC-14076
Y1 = samd21-temp:CRYSTAL: Various standard crystals. Proven footprints.; PROD_ID: XTAL-13062